# EAGLE design darwin-water-temp-module (EAGLE 9.4.2)
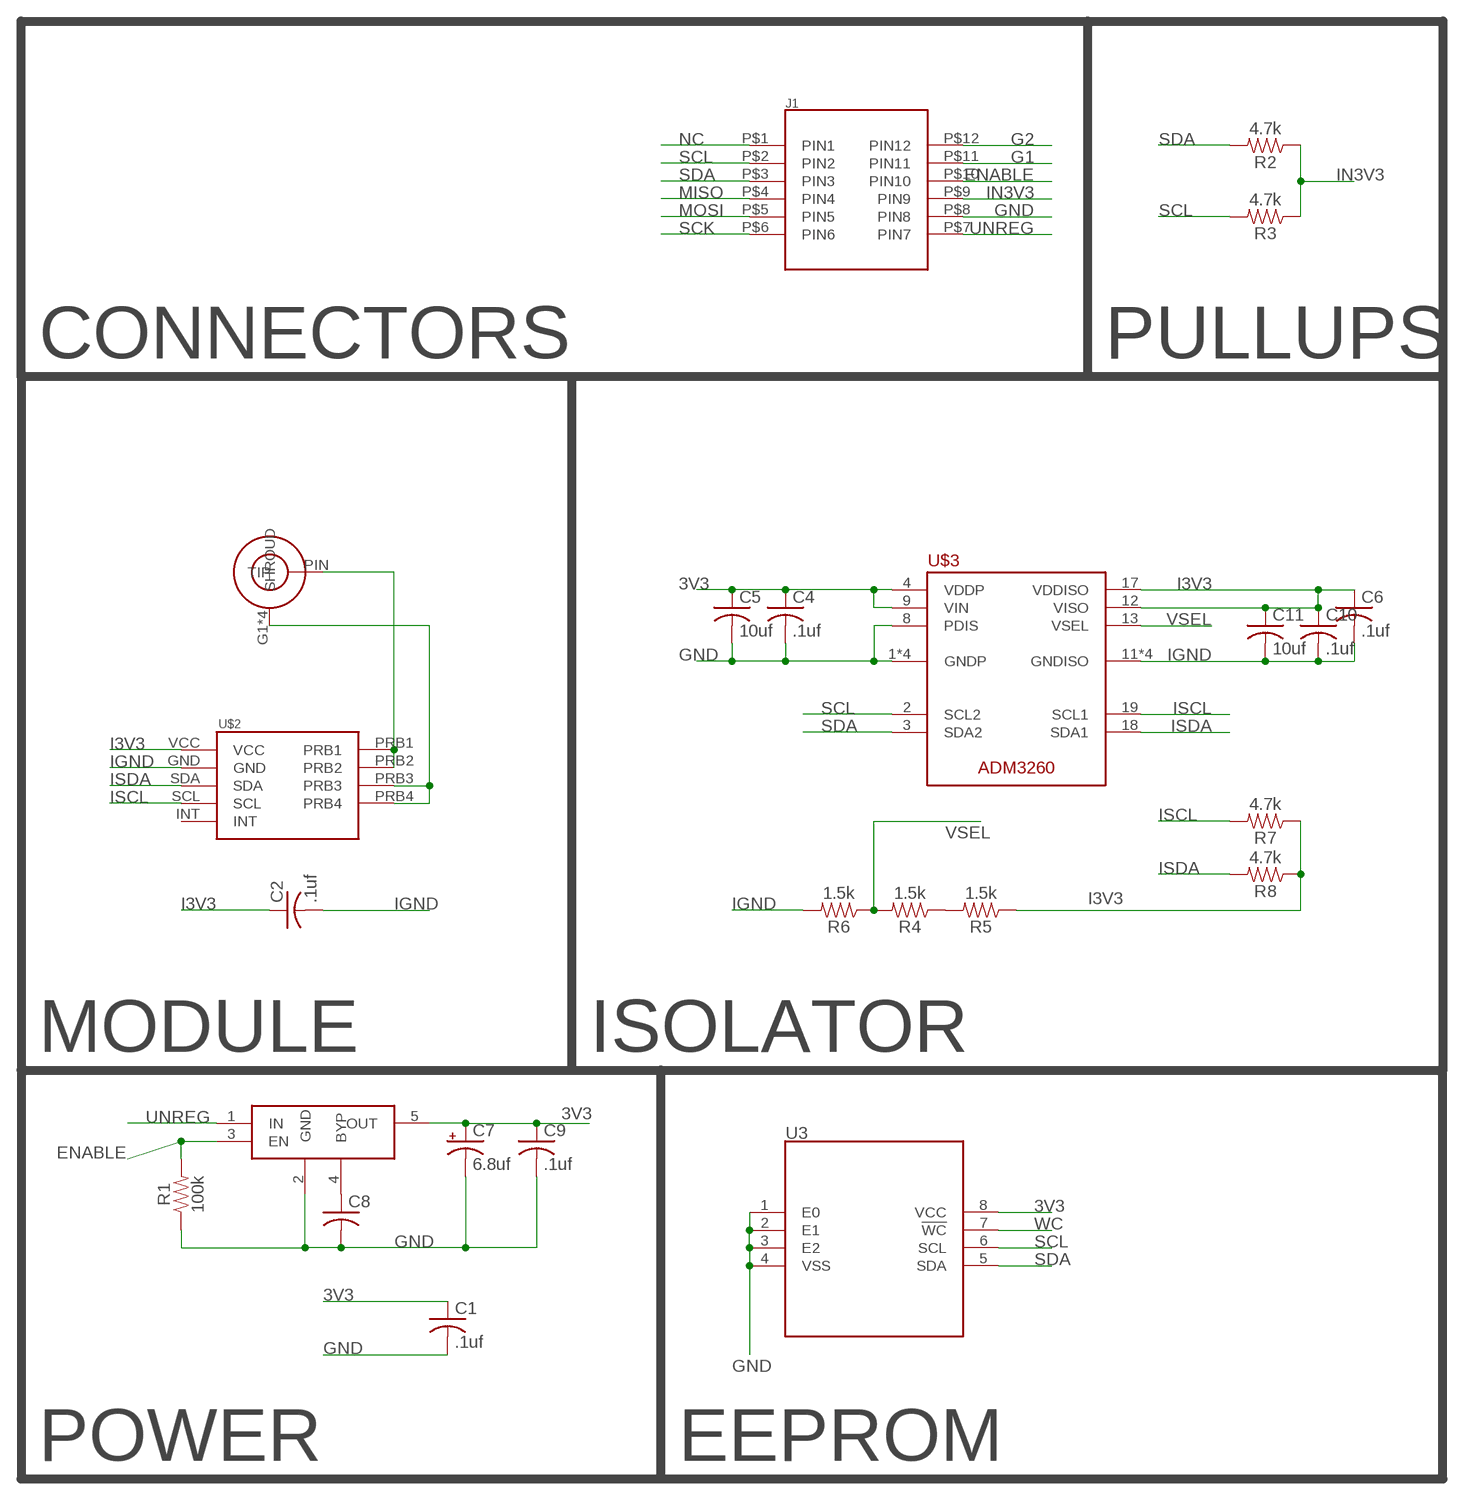
[diagram p0: schematic, sheet 1]

## Parts
C1  .1uf  C-USC0603K  [C0603K]
C2  .1uf  C-USC0603K  [C0603K]
C4  .1uf  C-USC0603K  [C0603K]
C5  10uf  C-USC0603K  [C0603K]
C6  .1uf  C-USC0603K  [C0603K]
C7  6.8uf  CPOL-USA/3216-18R  [A/3216-18R]
C8  C-USC0603K  [C0603K]
C9  .1uf  C-USC0603K  [C0603K]
C10  .1uf  C-USC0603K  [C0603K]
C11  10uf  C-USC0603K  [C0603K]
J1  2X6-HEADERS  [M20-7810645]
R1  100k  100KOHM-0603-1/10W-1%  [0603]
R2  4.7k  100KOHM-0603-1/10W-1%  [0603]
R3  4.7k  100KOHM-0603-1/10W-1%  [0603]
R4  1.5k  100KOHM-0603-1/10W-1%  [0603]
R5  1.5k  100KOHM-0603-1/10W-1%  [0603]
R6  1.5k  100KOHM-0603-1/10W-1%  [0603]
R7  4.7k  100KOHM-0603-1/10W-1%  [0603]
R8  4.7k  100KOHM-0603-1/10W-1%  [0603]
U3  M24C02-WMN6TP  [SOIC127P600X175-8]
U$1  5-1814832-1  [5-1814832-1]
U$2  ATLAS12P  [ATLAS-12P]
U$3  ADM3260  [SOP65P780X200-20]
U$4  MIC5219-3.3YM5-TR  [SOT95P280X145-5]

## Nets
3V3: C1.1 C4.1 C5.1 C7.+ C9.1 U3.8(VCC) U$3.4(VDDP) U$3.9(VIN) U$4.5(OUT)
ENABLE: J1.P$10(PIN10) R1.2 U$4.3(EN)
G1: J1.P$11(PIN11)
G2: J1.P$12(PIN12)
GND: C1.2 C4.2 C5.2 C7.- C8.2 C9.2 J1.P$8(PIN8) R1.1 U3.1(E0) U3.2(E1) U3.3(E2) U3.4(VSS) U$3.1(GNDP) U$3.5(GNDP) U$3.7(GNDP) U$3.8(PDIS) U$3.10(GNDP) U$4.2(GND)
I3V3: C2.1 C6.1 C10.1 C11.1 R5.1 R7.1 R8.1 U$2.VCC U$3.12(VISO) U$3.17(VDDISO)
IGND: C2.2 C6.2 C10.2 C11.2 R6.2 U$2.GND U$3.11(GNDISO) U$3.14(GNDISO) U$3.16(GNDISO) U$3.20(GNDISO)
IN3V3: J1.P$9(PIN9) R2.1 R3.1
ISCL: R7.2 U$2.SCL U$3.19(SCL1)
ISDA: R8.2 U$2.SDA U$3.18(SDA1)
MISO: J1.P$4(PIN4)
MOSI: J1.P$5(PIN5)
N$2: U$1.PIN(TIP) U$2.PRB1 U$2.PRB2
N$3: R4.1 R5.2
N$6: C8.1 U$4.4(BYP)
NC: J1.P$1(PIN1)
PG: U$1.G1(SHROUD) U$1.G2(SHROUD) U$1.G3(SHROUD) U$1.G4(SHROUD) U$2.PRB3 U$2.PRB4
SCK: J1.P$6(PIN6)
SCL: J1.P$2(PIN2) R3.2 U3.6(SCL) U$3.2(SCL2)
SDA: J1.P$3(PIN3) R2.2 U3.5(SDA) U$3.3(SDA2)
UNREG: J1.P$7(PIN7) U$4.1(IN)
VSEL: R4.2 R6.1 U$3.13(VSEL)
WC: U3.7(!WC)
Unconnected: U$2.INT

## Notes on the sheet
- CONNECTORS | PULLUPS
- MODULE | ISOLATOR
- POWER | EEPROM

## Library data of the parts
C1 C2 C4-C6 C8-C11 = rcl:C-US: CAPACITOR, American symbol; SPICEPREFIX: C
C7 = rcl:CPOL-US: POLARIZED CAPACITOR, American symbol; SPICEPREFIX: C
J1 = Conservify:2X6-HEADERS
R1 = SparkFun-Resistors:100KOHM: 100kΩ resistor A resistor is a passive two-terminal electrical component that implements electrical resistance as a circuit element. Resistors act to reduce current flow, and, at the same time, act to lower voltage levels within circuits. - Wikipedia; PROD_ID: RES-07828
R2-R8 = SparkFun-Resistors:100KOHM: 100kΩ resistor A resistor is a passive two-terminal electrical component that implements electrical resistance as a circuit element. Resistors act to reduce current flow, and, at the same time, act to lower voltage levels within circuits. - Wikipedia; PROD_ID: RES-07828; VALUE: 100k
U3 = Conservify:M24C02-WMN6TP
U$1 = Conservify:5-1814832-1
U$2 = Conservify:ATLAS12P
U$3 = Conservify:ADM3260
U$4 = Conservify:MIC5219-3.3YM5-TR

## Board
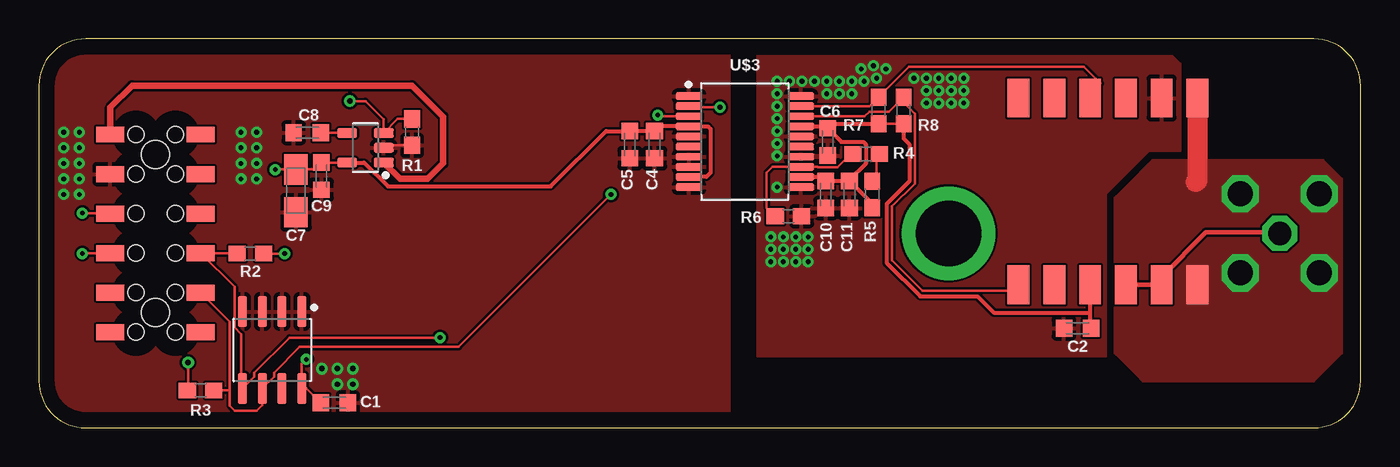
[diagram p1: board, top side]
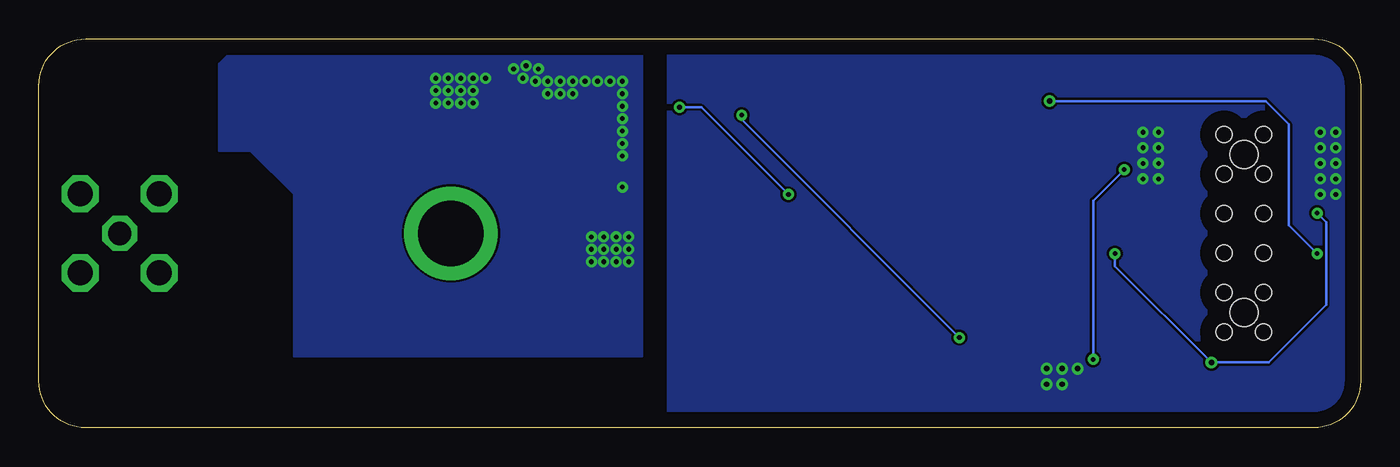
[diagram p2: board, bottom side, seen from below]

Size 85 x 25 mm. Coordinates in mm from the lower left corner, seen from the top.
Outline: 0,22 0,3 arc90 3,0 82,0 arc90 85,3 85,22 arc90 82,25 3,25 arc90 0,22
Copper layers (1*16): Top 0.035mm / dielectric 1.5mm / Bottom 0.035mm
Design rules "default *": minimum track width 6mil, minimum drill 0.3mm, track to track 6mil, track to pad 6mil, pad to pad 6mil, via to via 6mil, smd to smd 6mil, copper to edge 40mil, drill to drill 6mil, minimum pad ring 10mil, minimum via ring 8mil, stop-mask expansion 4mil, vias tented up to drill 0.3mm, thermal gap 10mil

### Footprints (pad centres in the part's own frame; a part is rotated, then mirrored left to right if it is on the bottom)
C0603K = smd 1.05 x 1.08: 1 -0.875,0; 2 0.875,0
A/3216-18R = smd 1.95 x 1.5: + 1.375,0; - -1.375,0
M20-7810645 = smd 1.02 x 1.78: P$1 -6.35,-2.91; P$2 -3.81,-2.91; P$3 -1.27,-2.91; P$4 1.27,-2.91; P$5 3.81,-2.91; P$6 6.35,-2.91; P$7 6.35,2.91; P$8 3.81,2.91; P$9 1.27,2.91; P$10 -1.27,2.91; P$11 -3.81,2.91; P$12 -6.35,2.91 | hole 1.02: -6.35,1.27; -3.81,1.27; -1.27,1.27; 1.27,1.27; 3.81,1.27; 6.35,1.27; 6.35,-1.27; 3.81,-1.27; 1.27,-1.27; -1.27,-1.27; -3.81,-1.27; -6.35,-1.27 | hole 1.8: -5.08,0; 5.08,0
0603 = smd 1.1 x 1: 1 -0.85,0; 2 0.85,0
SOIC127P600X175-8 = smd 1.968 x 0.569: 1 -2.473,1.905; 2 -2.473,0.635; 3 -2.473,-0.635; 4 -2.473,-1.905; 5 2.473,-1.905; 6 2.473,-0.635; 7 2.473,0.635; 8 2.473,1.905
5-1814832-1 = drill 1.6 octagon: G1 -2.54,2.54; G2 -2.54,-2.54; G3 2.54,-2.54; G4 2.54,2.54 | drill 1.5 octagon: PIN 0,0
ATLAS-12P = smd 2.5 x 1.4: GND 6,-3.2; INT 6,-0.9; NC -6,3.7; NC2 6,3.7; NC3 6,6; PRB1 -6,-0.9; PRB2 -6,-3.2; PRB3 -6,-5.5; PRB4 6,-5.5; SCL 6,1.4; SDA -6,6; VCC -6,1.4
SOP65P780X200-20 = smd 1.702 x 0.475: 1 -3.603,2.925; 2 -3.603,2.275; 3 -3.603,1.625; 4 -3.603,0.975; 5 -3.603,0.325; 6 -3.603,-0.325; 7 -3.603,-0.975; 8 -3.603,-1.625; 9 -3.603,-2.275; 10 -3.603,-2.925; 11 3.603,-2.925; 12 3.603,-2.275; 13 3.603,-1.625; 14 3.603,-0.975; 15 3.603,-0.325; 16 3.603,0.325; 17 3.603,0.975; 18 3.603,1.625; 19 3.603,2.275; 20 3.603,2.925
SOT95P280X145-5 = smd 1.262 x 0.609: 1 -1.175,0.95; 2 -1.175,0; 3 -1.175,-0.95; 4 1.175,-0.95; 5 1.175,0.95

### Placement (x,y rotation side)
C1  19,1.6 0 top
C2  66.8,6.4 180 top
C4  39.6,18.2 270 top
C5  38,18.2 270 top
C6  50.73,18.38 270 top
C7  16.54,15.23 90 top
C8  17.25,18.97 180 top
C9  18.17,16.18 270 top
C10  50.6,15 270 top
C11  52.13,15 270 top
J1  7.5,12.5 90 top
R1  24,19 90 top
R2  13.6,11.2 180 top
R3  10.4,2.4 0 top
R4  53.2,17.6 180 top
R5  53.6,15 90 top
R6  48.2,13.6 0 top
R7  54,20.4 90 top
R8  55.6,20.4 90 top
U3  15,5 270 top
U$1  79.8,12.5 0 top
U$2  69,15.2 90 top
U$3  45.4,18.4 0 top
U$4  21,18 180 top

### Tracks (layer width: path | path; a pad name or v marks a point on that pad's centre or on a via)
3V3  (via drill 0.3)
  Top 0.152: 19.95,17.05 U$4.5 C9.1 17.73,16.61 C7.+ v15.21,16.61 v15.2,16.6 | C1.1 17.2,2.53 | 17.2,2.53 17,2.73 | 17.2,2.53 U3.8 16.91,4.11 v17.2,4.4
  Top 0.254: U$3.9 42.92,16.12 43.2,16.4 43.2,19.2 43.02,19.38 U$3.4 39.9,19.38 C4.1 C5.1 36.48,19.07 32.92,15.52 22.45,15.52 20.92,17.05 U$4.5
  Bottom 0.152: v17.2,4.4 17.2,14.6 v15.2,16.6
ENABLE  (via drill 0.3, 0.35)
  Top 0.152: R1.2 23.07,19.85 U$4.3 22.18,19.82 21,21 v20,21 | v2.8,11.2 2.83,11.23 J1.P$10
  Bottom 0.152: v20,21 6.11,21 4.63,19.51 4.63,13.03 v2.8,11.2
GND  (via drill 0.3, 0.35)
  Top 0.152: U$4.2 22.32,18.15 R1.1
  other vias: 13,19 14,19 14,18 13,18 14,17 13,17 14,16 1.6,19 1.6,18 1.6,17 1.6,16 1.6,15 2.6,19 2.6,18 2.6,17 2.6,16 2.6,15 20.2,3.8 18.2,3.8 19.2,3.8 19.2,2.8 20.2,2.8 13,16
  pour Top: 0,25 44.4,25 44.4,0 0,0
  pour Bottom: 0,25 44.4,25 44.4,0 0,0
I3V3
  Top 0.152: 53.83,19.38 R7.1 R8.1 | 67.6,6.47 C2.1
  Top 0.254: R8.1 55.6,18.6 55.97,18.23 55.97,15.84 54.52,14.38 54.52,10.62 56.69,8.44 60.36,8.44 61.4,7.4 67.6,7.4 | 68.06,8.65 U$2.VCC 67.6,7.4 | U$3.12 50.35,16.12 C10.1 C11.1 | C6.1 51.6,18.38 53.02,18.38 53.18,18.22 53.18,16.98 52.13,15.93 C11.1 | C11.1 53.6,14.4 R5.1 | U$3.17 50.61,19.38 C6.1 | C6.1 51.03,19.55 R7.1 | 67.6,7.4 67.6,6.47
IGND  (via drill 0.3)
  other vias: 47.47,15.47 47.47,17.47 47.47,18.27 47.47,19.07 47.47,19.87 47.47,20.67 47.47,21.47 47.07,12.27 47.87,12.27 48.67,12.27 49.47,12.27 47.07,11.47 47.87,11.47 48.67,11.47 47.07,10.67 49.47,11.47 48.27,22.27 49.07,22.27 49.87,22.27 50.67,21.47 51.47,21.47 52.27,21.47 50.67,22.27 51.47,22.27 52.27,22.27 47.47,22.27 53.07,22.27 53.87,22.47 53.67,23.27 54.47,23.07 52.87,23.07 56.27,22.47 57.07,22.47 57.87,22.47 58.67,22.47 59.47,22.47 57.07,21.67 57.87,21.67 58.67,21.67 59.47,21.67 57.07,20.87 57.87,20.87 58.67,20.87 59.47,20.87 47.87,10.67 48.67,10.67 49.47,10.67
  pour Bottom: 46.2,4.6 46.2,24 72.8,24 73.4,23.4 73.4,17.8 71.4,17.8 68.6,15 68.6,4.6
  pour Top: 73.4,17.8 73.4,23.4 72.8,24 46.2,24 46.2,4.6 68.6,4.6 68.6,15 71.4,17.8
IN3V3  (via drill 0.3, 0.35)
  Top 0.152: v9.6,4.2 9.6,2.45 R3.1 | R2.1 v15.8,11.2 | v2.8,13.8 4.56,13.8 J1.P$9
  Bottom 0.152: v15.8,11.2 15.8,10.4 v9.6,4.2 5.91,4.2 2.22,7.9 2.22,13.22 v2.8,13.8
ISCL
  Top 0.152: U$3.19 53.42,20.68 R7.2 55.95,23.2 67.2,23.2 68.27,22.13 U$2.SCL
ISDA
  Top 0.152: U$3.18 53.1,20.02 53.41,20.33 54.68,20.33 R8.2 55.6,20.92 56.33,20.2 56.33,15.7 54.87,14.24 54.87,10.76 56.83,8.8 63.6,8.8 U$2.SDA
N$1  (via drill 4.2 pad 6)
  other vias: 58.5,12.5
N$2
  Top 0.305: U$2.PRB1 U$2.PRB2 72.2,9.72 75.06,12.57 79.73,12.57 U$1.PIN
N$3
  Top 0.152: R4.1 53.85,17.4 53.85,16.1 R5.2
N$6
  Top 0.152: C8.1 19.81,18.97 U$4.4
PG
  Top 1.27: U$2.PRB4 74.5,15.9 74.4,15.8
  pour Top (no thermals): 69.2,4.8 69.2,14.8 71.6,17.2 82.6,17.2 83.8,16 83.8,4.8 82,3 71,3
SCL  (via drill 0.3)
  Top 0.152: J1.P$2 12.28,6.82 12.28,2.42 | 12.28,2.42 12.28,1.42 12.6,1.1 12.6,1.09 14,1.09 14.37,1.46 U3.6 15.12,3.28 15.12,3.54 16.78,5.2 27,5.2 v36.8,15 | R3.2 12.26,2.4 12.28,2.42 | v43.8,20.6 41.87,20.6 U$3.2
  Bottom 0.152: v36.8,15 42.4,20.6 v43.8,20.6
SDA  (via drill 0.3)
  Top 0.152: R2.2 12.72,11.23 J1.P$3 12.58,9.06 12.58,6.46 13.02,6.02 13.02,2.6 U3.5 13.85,3.28 13.85,3.54 16.11,5.8 v25.8,5.8 | v39.8,20.11 39.88,20.02 U$3.3
  Bottom 0.152: v25.8,5.8 39.8,19.8 v39.8,20.11
UNREG
  Top 0.406: J1.P$7 4.59,20.59 6,22 24,22 26,20 26,17 25,16 23.23,16 U$4.1
VSEL
  Top 0.152: R4.2 52.22,17.6 51.37,16.75 50.1,16.75 50.07,16.77 U$3.13 47.17,16.77 46.8,16.4 46.8,14.15 R6.1